# Altium schematic sheet Penguin_Base.SchDoc
size A4; SheetNumber: 1; SheetTotal: 1
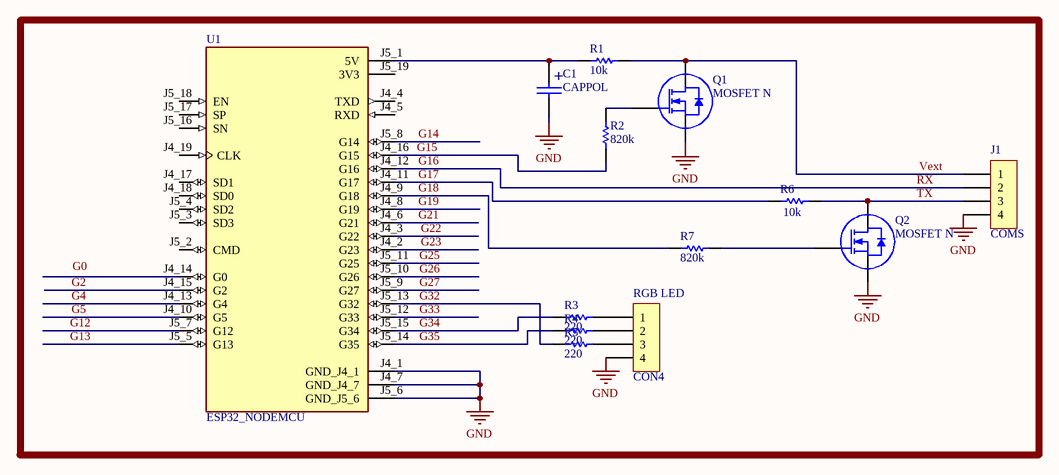
[diagram p0: Penguin_Base.SchDoc]

## Parts
C1  CAPPOL  [CAP100RP]
J1  COMS  [SIP4]
Q1  MOSFET N  [JUMPER3]
Q2  MOSFET N  [JUMPER3]
R1  10k  [RES400]
R2  820k  [RES400]
R3  220  [RES400]
R4  220  [RES400]
R5  220  [RES400]
R6  10k  [RES400]
R7  820k  [RES400]
RGB_LED  CON4  [SIP4]
U1  ESP32_NODEMCU  [MODULE_ESP32_NODEMCU]

## Nets
GND: C1.2 J1.4 Q1.3(S) Q2.3(S) RGB_LED.4 U1.J4_1(GND_J4_1) U1.J4_7(GND_J4_7) U1.J5_6(GND_J5_6)
G2: U1.J4_15(G2)
G4: U1.J4_13(G4)
G5: U1.J4_10(G5)
G12: U1.J5_7(G12)
G13: U1.J5_5(G13)
G14: U1.J5_8(G14)
G15: R2.1 U1.J4_16(G15)
G16: J1.2 U1.J4_12(G16)  [also labelled RX]
G17: R6.1 U1.J4_11(G17)
G18: R7.1 U1.J4_9(G18)
G19: U1.J4_8(G19)
G21: U1.J4_6(G21)
G22: U1.J4_3(G22)
G23: U1.J4_2(G23)
G25: U1.J5_11(G25)
G26: U1.J5_10(G26)
G27: U1.J5_9(G27)
G32: R5.1 U1.J5_13(G32)
G33: U1.J5_12(G33)
G34: R3.1 U1.J5_15(G34)
G35: R4.1 U1.J5_14(G35)
TX: J1.3 Q2.2(D) R6.2
Vext: J1.1 Q1.2(D) R1.2
NetC1_1: C1.1 R1.1 U1.J5_1(5V)
NetQ1_1: Q1.1(G) R2.2
NetQ2_1: Q2.1(G) R7.2
NetR3_2: R3.2 RGB_LED.1
NetR4_2: R4.2 RGB_LED.2
NetR5_2: R5.2 RGB_LED.3

Not connected (* = marked no-connect by the designer): U1 J4_4(TXD) J4_5(RXD) J4_14(G0) J4_17(SD1) J4_18(SD0) J4_19(CLK) J5_2(CMD) J5_3(SD3) J5_4(SD2) J5_16(SN) J5_17(SP) J5_18(EN) J5_19(3V3)

## Notes on the sheet
- Labels drawn without touching a wire or pin: G0
- (in symbol CAPPOL) +

## Library data of the parts
J1 = CON4
Q1 Q2 = MOSFET N: pin to pad: 1>2 2>1
R1-R7 = RES
U1 = ESP32_NODEMCU: NodeMCU is an open source loT platform. ESP32 is a series of low cost, low powersystem-on-chip (SoC) microcontrollers with integrated Wi-Fi & dual-mode Bluetooth.; MP: ESP32 NodeMCU; MF: Espressif Systems; Package: Package; SnapEDA_Link: https://www.snapeda.com/parts/ESP32%20NodeMCU/Espressif+Systems/view-part/?ref=snap; Availability: Not in stock; Value: *; Check_prices: https://www.snapeda.com/parts/ESP32%20NodeMCU/Espressif+Systems/view-part/?ref=eda; Price: None